# EAGLE schematic mate_a (EAGLE 9.6.2)
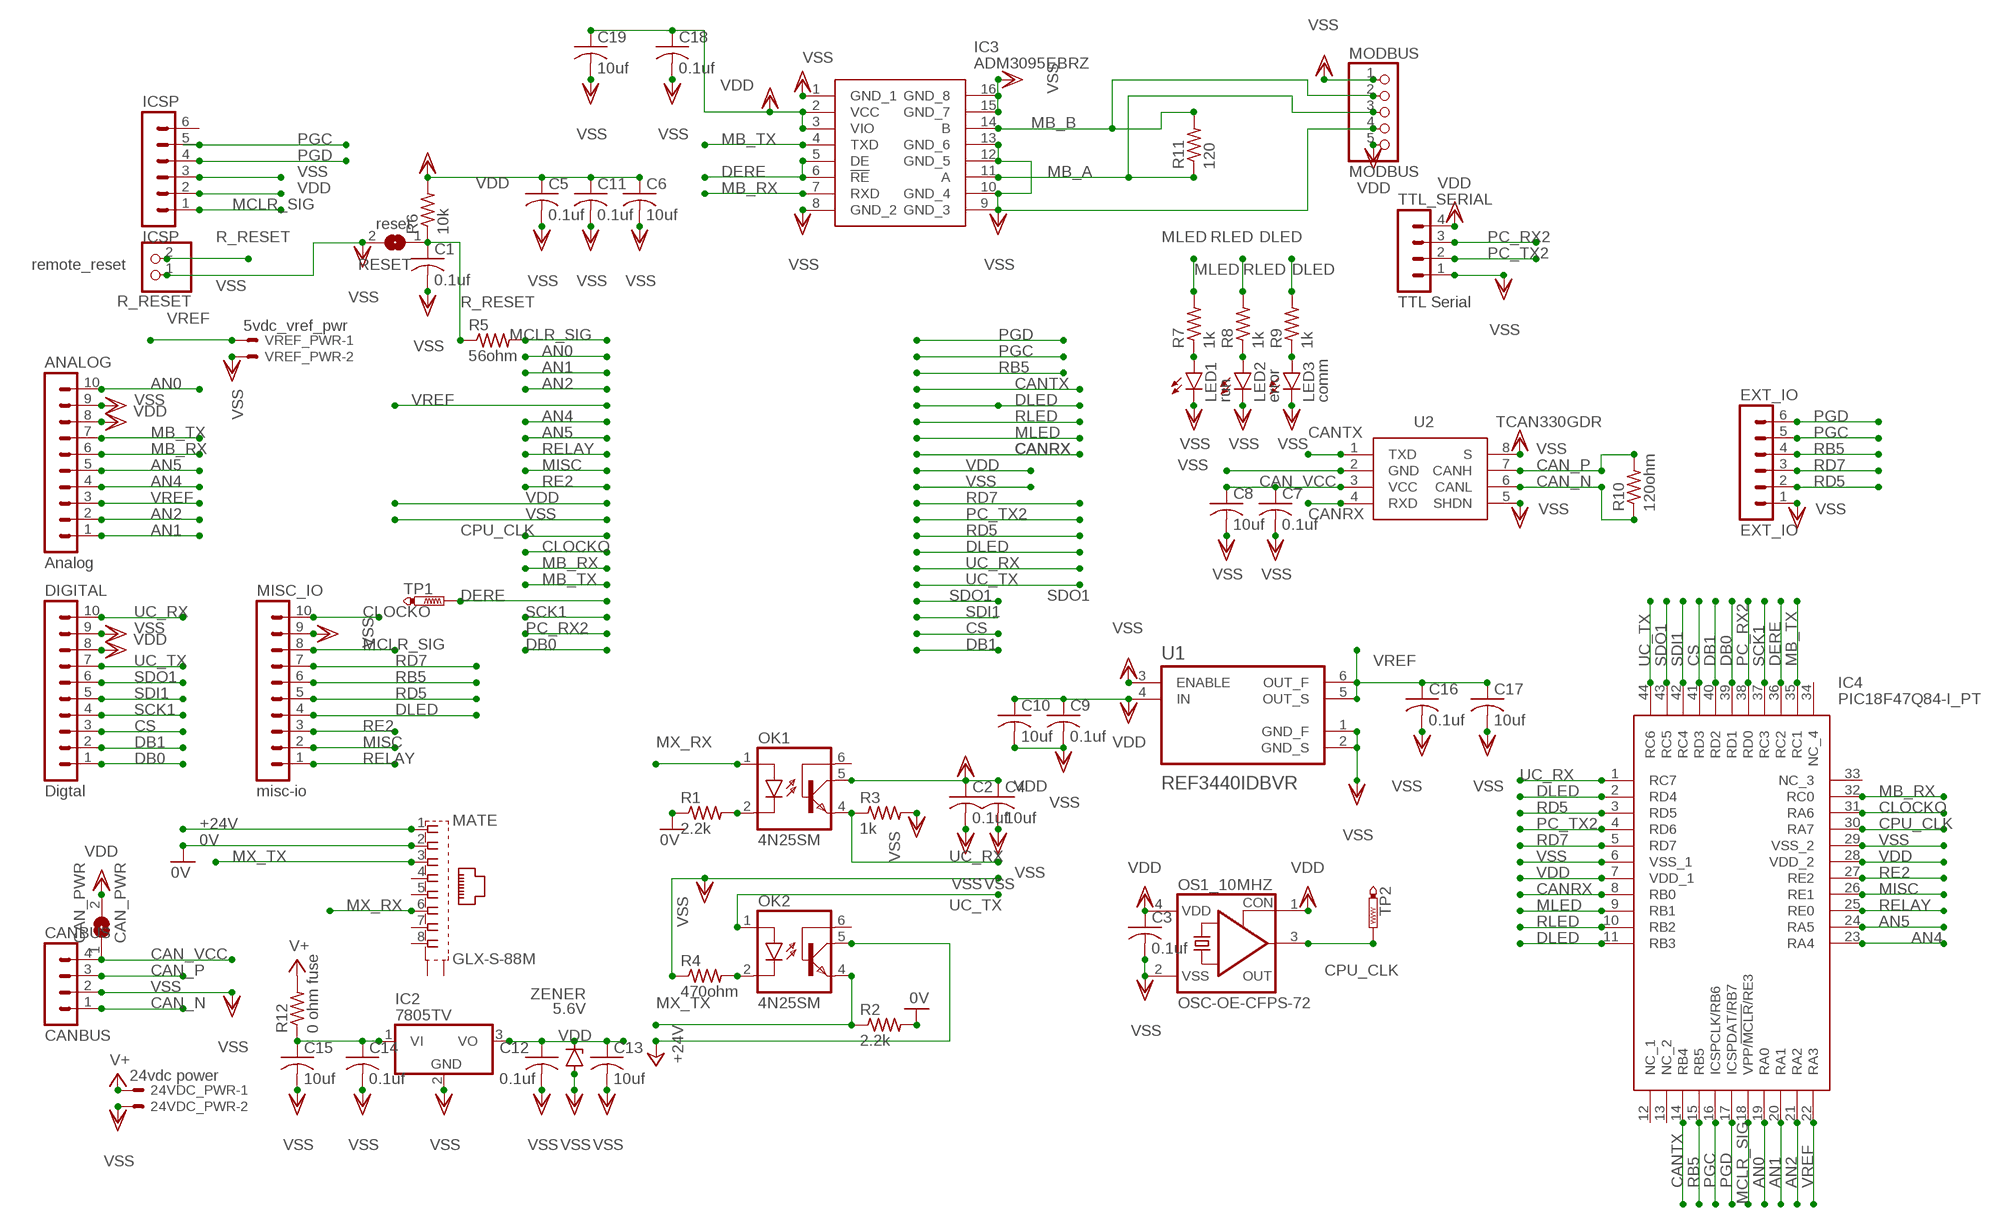
[diagram p0: schematic, sheet 1]

## Parts
24VDC_PWR  24vdc power  22-23-2021  [22-23-2021]
ANALOG  Analog  MA10-1  [MA10-1]
C1  0.1uf  C-USC0805  [C0805]
C2  0.1uf  C-USC0805  [C0805]
C3  0.1uf  C-USC0805  [C0805]
C4  10uf  C-USC0805  [C0805]
C5  0.1uf  C-USC0805  [C0805]
C6  10uf  C-USC0805  [C0805]
C7  0.1uf  C-USC0805  [C0805]
C8  10uf  C-USC0805  [C0805]
C9  0.1uf  C-USC0805  [C0805]
C10  10uf  C-USC0805  [C0805]
C11  0.1uf  C-USC0805  [C0805]
C12  0.1uf  C-USC0805  [C0805]
C13  10uf  C-USC0805  [C0805]
C14  0.1uf  C-USC0805  [C0805]
C15  10uf  C-USC0805  [C0805]
C16  0.1uf  C-USC0805  [C0805]
C17  10uf  C-USC0805  [C0805]
C18  0.1uf  C-USC0805  [C0805]
C19  10uf  C-USC0805  [C0805]
CAN_PWR  CAN_PWR  SJ  [SJ]
CANBUS  CANBUS  MA04-1  [MA04-1]
DIGITAL  Digtal  MA10-1  [MA10-1]
EXT_IO  EXT_IO  MA06-1  [MA06-1]
IC2  7805TV  [TO220V]
IC3  ADM3095EBRZ  [SOIC127P600X175-16N]
IC4  PIC18F47Q84-I_PT  [QFP80P1200X1200X120-44N]
ICSP  ICSP  MA06-1  [MA06-1]
LED1  run  LEDCHIPLED_0805  [CHIPLED_0805]
LED2  error  LEDCHIPLED_0805  [CHIPLED_0805]
LED3  comm  LEDCHIPLED_0805  [CHIPLED_0805]
MATE  GLX-S-88M  [GLX-S-88M]
MISC_IO  misc-io  MA10-1  [MA10-1]
MODBUS  MODBUS  PINHD-1X5  [1X05]
OK1  4N25SM  [DIL6-SMD]
OK2  4N25SM  [DIL6-SMD]
OS1_10MHZ  OSC-OE-CFPS-72  [7.2X5.2-4-PAD]
R1  2.2k  R-US_R0805  [R0805]
R2  2.2k  R-US_R0805  [R0805]
R3  1k  R-US_R0805  [R0805]
R4  470ohm  R-US_R0805  [R0805]
R5  56ohm  R-US_R0805  [R0805]
R6  10k  R-US_R0805  [R0805]
R7  1k  R-US_R0805  [R0805]
R8  1k  R-US_R0805  [R0805]
R9  1k  R-US_R0805  [R0805]
R10  120ohm  R-US_R0805  [R0805]
R11  120  R-US_R0805  [R0805]
R12  0 ohm fuse  R-US_R1206  [R1206]
R_RESET  remote_reset  PINHD-1X2  [1X02]
RESET  reset  SJ  [SJ]
TP1  PTR1PAD1-13  [P1-13]
TP2  PTR1PAD1-13  [P1-13]
TTL_SERIAL  TTL Serial  MA04-1  [MA04-1]
U1  REF3440IDBVR  [SOT95P280X145-6N]
U2  TCAN330GDR  [SOIC127P600X175-8N]
VREF_PWR  5vdc_vref_pwr  22-23-2021  [22-23-2021]
ZENER  5.6V  ZENER-DIODESMB  [SMB]

## Nets
0V [icurrent]: MATE.2 R1.1 R2.2
+24V [icurrent]: MATE.1 OK2.5(COL)
AN0: ANALOG.10 IC4.19(RA0)
AN1: ANALOG.1 IC4.20(RA1)
AN2: ANALOG.2 IC4.21(RA2)
AN4: ANALOG.4 IC4.23(RA4)
AN5: ANALOG.5 IC4.24(RA5)
CAN_N [icurrent]: CANBUS.1 R10.1 U2.6(CANL)
CAN_P [icurrent]: CANBUS.3 R10.2 U2.7(CANH)
CAN_VCC [icurrent]: C7.1 C8.1 CAN_PWR.1 CANBUS.4 U2.3(VCC)
CANRX: IC4.8(RB0) U2.4(RXD)
CANTX: IC4.14(RB4) U2.1(TXD)
CLOCKO: IC4.31(RA6) MISC_IO.10
CPU_CLK: IC4.30(RA7) OS1_10MHZ.3(OUT) TP2.TP
CS: DIGITAL.3 IC4.41(RD3)
DB0: DIGITAL.1 IC4.39(RD1)
DB1: DIGITAL.2 IC4.40(RD2)
DERE: IC3.5(DE) IC3.6(!RE) IC4.36(RC2) TP1.TP
DLED: IC4.2(RD4) IC4.11(RB3) MISC_IO.4 R9.2
MB_A: IC3.11(A) MODBUS.3 R11.1
MB_B: IC3.14(B) MODBUS.2 R11.2
MB_RX: ANALOG.6 IC3.7(RXD) IC4.32(RC0)
MB_TX: ANALOG.7 IC3.4(TXD) IC4.35(RC1)
MCLR_SIG: IC4.18(VPP/!MCLR!/RE3) ICSP.1 MISC_IO.8 R5.2
MISC: IC4.26(RE1) MISC_IO.2
MLED: IC4.9(RB1) R7.2
MX_RX: MATE.6 OK1.1(A)
MX_TX: MATE.3 OK2.4(EMI) R2.1
N$1: OK1.2(C) R1.2
N$2 [icurrent]: C14.1 C15.1 IC2.1(VI) R12.1
N$3: OK2.2(C) R4.2
N$4: LED1.A R7.1
N$5: LED2.A R8.1
N$6: LED3.A R9.1
PC_RX2: IC4.38(RD0) TTL_SERIAL.3
PC_TX2: IC4.4(RD6) TTL_SERIAL.2
PGC: EXT_IO.5 IC4.16(ICSPCLK/RB6) ICSP.5
PGD: EXT_IO.6 IC4.17(ICSPDAT/RB7) ICSP.4
R_RESET: C1.1 R5.1 R6.1 R_RESET.2 RESET.1
RB5: EXT_IO.4 IC4.15(RB5) MISC_IO.6
RD5: EXT_IO.2 IC4.3(RD5) MISC_IO.5
RD7: EXT_IO.3 IC4.5(RD7) MISC_IO.7
RE2: IC4.27(RE2) MISC_IO.3
RELAY: IC4.25(RE0) MISC_IO.1
RLED: IC4.10(RB2) R8.2
SCK1: DIGITAL.4 IC4.37(RC3)
SDI1: DIGITAL.5 IC4.42(RC4)
SDO1: DIGITAL.6 IC4.43(RC5)
UC_RX: DIGITAL.10 IC4.1(RC7) OK1.4(EMI) R3.1
UC_TX: DIGITAL.7 IC4.44(RC6) OK2.1(A)
V+ [icurrent]: 24VDC_PWR.1 R12.2
VDD [icurrent]: ANALOG.8 C2.1 C3.1 C4.1 C5.1 C6.1 C9.1 C10.1 C11.1 C12.1 C13.1 C18.1 C19.1 CAN_PWR.2 DIGITAL.8 IC2.3(VO) IC3.2(VCC) IC3.3(VIO) IC4.7(VDD_1) IC4.28(VDD_2) ICSP.2 MODBUS.5 OK1.5(COL) OS1_10MHZ.1(CON) OS1_10MHZ.4(VDD) R6.2 TTL_SERIAL.4 U1.4(IN) ZENER.C
VREF [icurrent]: ANALOG.3 C16.1 C17.1 IC4.22(RA3) U1.5(OUT_S) U1.6(OUT_F) VREF_PWR.1
VSS [icurrent]: 24VDC_PWR.2 ANALOG.9 C1.2 C2.2 C3.2 C4.2 C5.2 C6.2 C7.2 C8.2 C9.2 C10.2 C11.2 C12.2 C13.2 C14.2 C15.2 C16.2 C17.2 C18.2 C19.2 CANBUS.2 DIGITAL.9 EXT_IO.1 IC2.2(GND) IC3.1(GND_1) IC3.8(GND_2) IC3.9(GND_3) IC3.10(GND_4) IC3.12(GND_5) IC3.13(GND_6) IC3.15(GND_7) IC3.16(GND_8) IC4.6(VSS_1) IC4.29(VSS_2) ICSP.3 LED1.C LED2.C LED3.C MISC_IO.9 MODBUS.1 MODBUS.4 OS1_10MHZ.2(VSS) R3.2 R4.1 R_RESET.1 RESET.2 TTL_SERIAL.1 U1.1(GND_F) U1.2(GND_S) U1.3(ENABLE) U2.2(GND) U2.5(SHDN) U2.8(S) VREF_PWR.2 ZENER.A
Unconnected: IC4.12(NC_1) IC4.13(NC_2) IC4.33(NC_3) IC4.34(NC_4) ICSP.6 MATE.4 MATE.5 MATE.7 MATE.8 MATE.S1 MATE.S2 OK1.6(BAS) OK2.6(BAS)

## Library data of the parts
24VDC_PWR VREF_PWR = con-molex:22-23-2021: .100" (2.54mm) Center Header - 2 Pin; MF: MOLEX; MPN: 22-23-2021; OC_FARNELL: 1462926; OC_NEWARK: 25C3832
ANALOG DIGITAL MISC_IO = con-lstb:MA10-1: PIN HEADER; OC_FARNELL: unknown; OC_NEWARK: unknown
C1-C19 = rcl:C-US: CAPACITOR, American symbol; SPICEPREFIX: C
CAN_PWR RESET = jumper:SJ: SMD solder JUMPER
CANBUS TTL_SERIAL = con-lstb:MA04-1: PIN HEADER; OC_FARNELL: unknown; OC_NEWARK: unknown
EXT_IO ICSP = con-lstb:MA06-1: PIN HEADER; OC_FARNELL: unknown; OC_NEWARK: unknown
IC2 = linear:78*: Positive VOLTAGE REGULATOR Source: http://cache.national.com/ds/LM/LM78L05.pdf http://www.fairchildsemi.com/ds/LM/LM7805.pdf
IC3 = ADM3095EBRZ:ADM3095EBRZ: Level 4 EMC Protected RS-485 Transceiver with Full +/-42 V Fault Protection Source: Datasheet <https://componentsearchengine.com/Datasheets/1/ADM3095EBRZ.pdf>; DESCRIPTION: Level 4 EMC Protected RS-485 Transceiver with Full +/-42 V Fault Protection; HEIGHT: 1.75mm; MANUFACTURER_NAME: Analog Devices; MANUFACTURER_PART_NUMBER: ADM3095EBRZ; MOUSER_PART_NUMBER: 584-ADM3095EBRZ; MOUSER_PRICE-STOCK: https://www.mouser.com/Search/Refine.aspx?Keyword=584-ADM3095EBRZ
IC4 = PIC18F47Q84-I_PT:PIC18F47Q84-I_PT: 8-bit Microcontrollers - MCU CAN-FD, 128KB Flash, 13KB RAM, 12b ADC3, UTMR, DAC, Comp, PWM, CCP, CWG, HLT, WWDT, SCAN/CRC, ZCD, PPS,Comms IDLE/DOZE/PMD, JTAG Source: Datasheet <https://ww1.microchip.com/downloads/en/DeviceDoc/PIC18F27-47-57Q84-Data-Sheet-40002213D.pdf>; DESCRIPTION: 8-bit Microcontrollers - MCU CAN-FD, 128KB Flash, 13KB RAM, 12b ADC3, UTMR, DAC, Comp, PWM, CCP, CWG, HLT, WWDT, SCAN/CRC, ZCD, PPS,Comms IDLE/DOZE/PMD, JTAG; HEIGHT: 1.2mm; MANUFACTURER_NAME: Microchip; MANUFACTURER_PART_NUMBER: PIC18F47Q84-I/PT; MOUSER_PART_NUMBER: 579-PIC18F47Q84-I/PT; MOUSER_PRICE-STOCK: https://www.mouser.co.uk/ProductDetail/Microchip-Technology/PIC18F47Q84-I-PT?qs=d0WKAl%252BL4KYthTnAmf%2FYSg%3D%3D
LED1-LED3 = led:LED: LED OSRAM: - CHIPLED LG R971, LG N971, LY N971, LG Q971, LY Q971, LO R971, LY R971 LH N974, LH R974 LS Q976, LO Q976, LY Q976 LO Q996 - Hyper CHIPLED LW Q18S LB Q993, LB Q99A, LB R99A - SideLED LS A670, LO A670, LY A670, LG A670, LP A670 LB A673, LV A673, LT A673, LW A673 LH A674 LY A675 LS A676, LA A676, LO A676, LY A676, LW A676 LS A679, LY A679, LG A679 - Hyper Micro SIDELED® LS Y876, LA Y876, LO Y876, LY Y876 LT Y87S - SmartLED LW L88C, LW L88S LB L89C, LB L89S, LG L890 LS L89K, LO L89K, LY L89K LS L896, LA L896, LO L896, LY L896 - TOPLED LS T670, LO T670, LY T670, LG T670, LP T670 LSG T670, LSP T670, LSY T670, LOP T670, LYG T670 LG T671, LOG T671, LSG T671 LB T673, LV T673, LT T673, LW T673 LH T674 LS T676, LA T676, LO T676, LY T676, LB T676, LH T676, LSB T676, LW T676 LB T67C, LV T67C, LT T67C, LS T67K, LO T67K, LY T67K, LW E67C LS E67B, LA E67B, LO E67B, LY E67B, LB E67C, LV E67C, LT E67C LW T67C LS T679, LY T679, LG T679 LS T770, LO T770, LY T770, LG T770, LP T770 LB T773, LV T773, LT T773, LW T773 LH T774 LS E675, LA E675, LY E675, LS T675 LS T776, LA T776, LO T776, LY T776, LB T776 LHGB T686 LT T68C, LB T68C - Hyper Mini TOPLED® LB M676 - Mini TOPLED Santana® LG M470 LS M47K, LO M47K, LY M47K Source: http://www.osram.convergy.de LUXEON: - LUMILED® LXK2-PW12-R00, LXK2-PW12-S00, LXK2-PW14-U00, LXK2-PW14-V00 LXK2-PM12-R00, LXK2-PM12-S00, LXK2-PM14-U00 LXK2-PE12-Q00, LXK2-PE12-R00, LXK2-PE12-S00, LXK2-PE14-T00, LXK2-PE14-U00 LXK2-PB12-K00, LXK2-PB12-L00, LXK2-PB12-M00, LXK2-PB14-N00, LXK2-PB14-P00, LXK2-PB14-Q00 LXK2-PR12-L00, LXK2-PR12-M00, LXK2-PR14-Q00, LXK2-PR14-R00 LXK2-PD12-Q00, LXK2-PD12-R00, LXK2-PD12-S00 LXK2-PH12-R00, LXK2-PH12-S00 LXK2-PL12-P00, LXK2-PL12-Q00, LXK2-PL12-R00 Source: www.luxeon.com KINGBRIGHT: KA-3528ASYC Source: www.kingbright.com
MATE = con-kycon:GLX-S-88M: Mod. Jack, Right Angle, 8 posiotion, 8 contatcs RJ45 Source: GLX-S-88M.pdf; OC_FARNELL: unknown; OC_NEWARK: unknown
MODBUS = pinhead:PINHD-1X5: PIN HEADER
OK1 OK2 = optocoupler:4N*?M: General Purpose 6-Pin Phototransistor Optocouplers Source: http://www.fairchildsemi.com/ds/4N/4N35-M.pdf; MF: FAIRCHILD SEMICONDUCTOR; MPN: 4N25SM; OC_FARNELL: 1021152; OC_NEWARK: 34C2020
OS1_10MHZ = IQD-Frequency-Products:OSC-OE: OSCILLATOR WITH OE
R1-R12 = rcl:R-US_: RESISTOR, American symbol; SPICEPREFIX: R
R_RESET = pinhead:PINHD-1X2: PIN HEADER
TP1 TP2 = testpad:PTR1: TEST PIN
U1 = REF3440IDBVR:REF3440IDBVR: Check availability <https://pricing.snapeda.com/parts/REF3440IDBVR/Texas%20Instruments/view-part?ref=eda>; AVAILABILITY: In Stock; DESCRIPTION: 4.1-V, low-drift, low-power, small-footprint series voltage reference; MF: Texas Instruments; MP: REF3440IDBVR; PACKAGE: SOT-23-6 Texas Instruments; PRICE: None; PURCHASE-URL: https://pricing.snapeda.com/search/part/REF3440IDBVR/?ref=eda
U2 = TCAN330GDR:TCAN330GDR: 3.3-V CAN Transceivers with CAN FD (Flexible Data Rate) Source: Datasheet <http://www.ti.com/lit/gpn/TCAN330G>; DESCRIPTION: 3.3-V CAN Transceivers with CAN FD (Flexible Data Rate); HEIGHT: 1.75mm; MANUFACTURER_NAME: Texas Instruments; MANUFACTURER_PART_NUMBER: TCAN330GDR; MOUSER_PART_NUMBER: 595-TCAN330GDR; MOUSER_PRICE-STOCK: https://www.mouser.co.uk/ProductDetail/Texas-Instruments/TCAN330GDR?qs=9DwIlvx97adeWwzxdqwSPw%3D%3D
ZENER = diode:ZENER-DIODE: Z-Diode

## Net classes
1 icurrent: width 0.305 mm